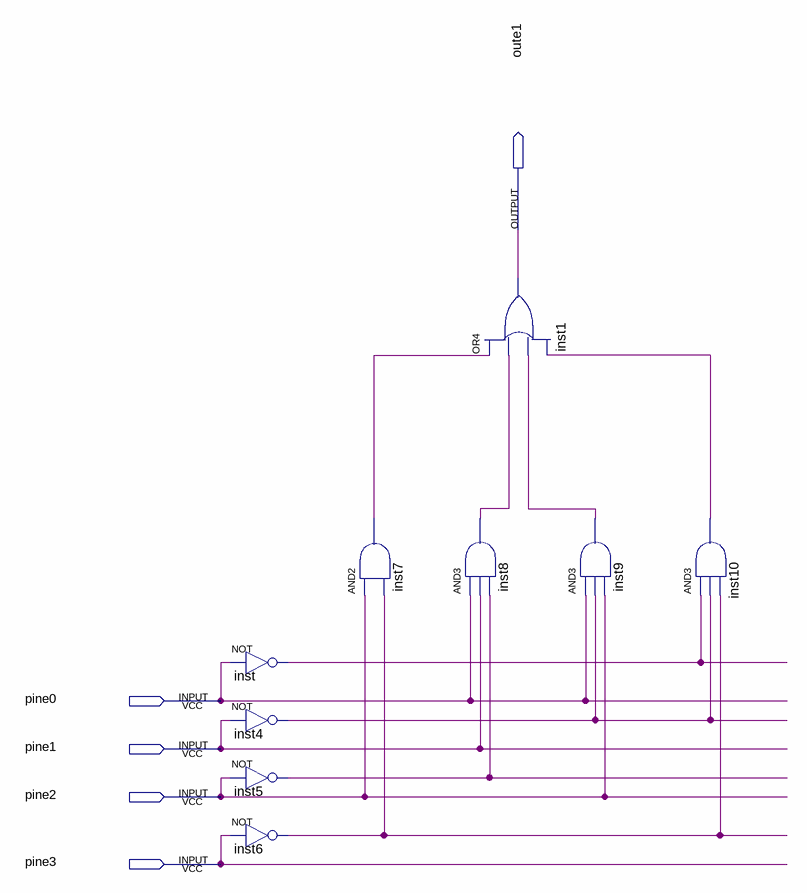
[diagram p0: schematic sheet]
// Quartus schematic OriginalE.bdf as structural Verilog: 9 symbols, 5 pins
module OriginalE (
  input  pine0,
  input  pine1,
  input  pine2,
  input  pine3,
  output oute1
);

  wire inst4_out, inst5_out, inst6_out, inst7_out, inst8_out, inst9_out, inst10_out, inst_out;

  not inst (inst_out, pine0);
  not inst4 (inst4_out, pine1);
  not inst5 (inst5_out, pine2);
  not inst6 (inst6_out, pine3);
  and inst7 (inst7_out, pine2, inst6_out);
  or inst1 (oute1, inst7_out, inst8_out, inst9_out, inst10_out);
  and inst8 (inst8_out, pine0, pine1, inst5_out);
  and inst9 (inst9_out, pine0, inst4_out, pine2);
  and inst10 (inst10_out, inst_out, inst4_out, inst6_out);
endmodule
